# EAGLE design Adafruit Feather M4 Express CAN (EAGLE 9.6.2)
COMPANY: ADAFRUIT INDUSTRIES; DRAWN: KTOWN; REV: B
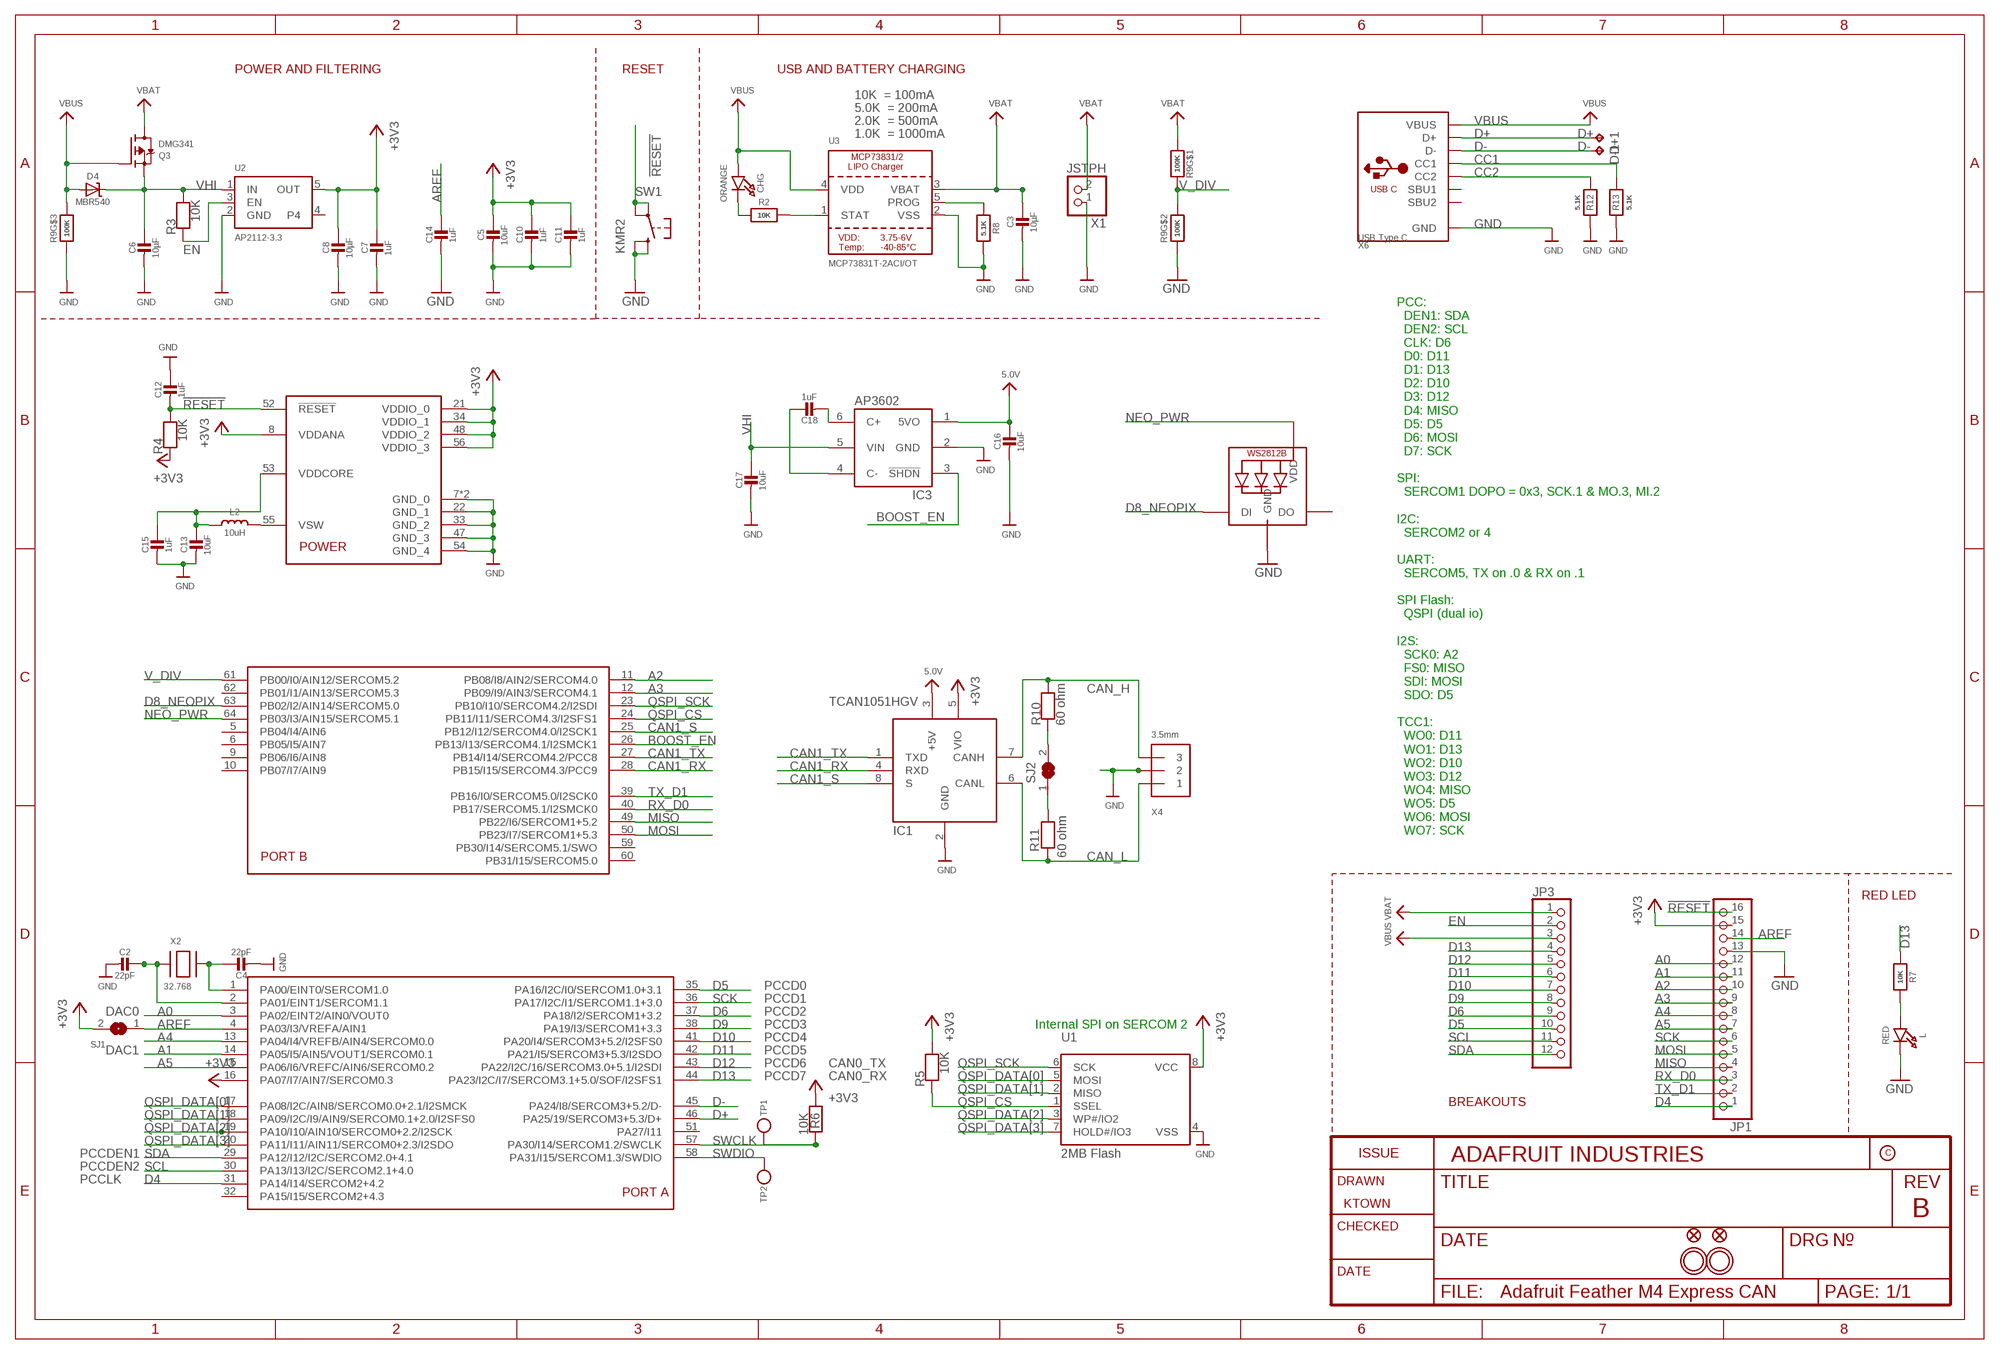
[diagram p0: schematic, sheet 1]

## Parts
C2  22pF  CAP_CERAMIC0603_NO  [0603-NO]
C3  10µF  CAP_CERAMIC0805-NOOUTLINE  [0805-NO]
C4  22pF  CAP_CERAMIC0603_NO  [0603-NO]
C5  10uF  CAP_CERAMIC0805-NOOUTLINE  [0805-NO]
C6  10µF  CAP_CERAMIC0805-NOOUTLINE  [0805-NO]
C7  1uF  CAP_CERAMIC0603_NO  [0603-NO]
C8  10µF  CAP_CERAMIC0805-NOOUTLINE  [0805-NO]
C10  1uF  CAP_CERAMIC0603_NO  [0603-NO]
C11  1uF  CAP_CERAMIC0603_NO  [0603-NO]
C12  1uF  CAP_CERAMIC0603_NO  [0603-NO]
C13  10uF  CAP_CERAMIC0805-NOOUTLINE  [0805-NO]
C14  1uF  CAP_CERAMIC0603_NO  [0603-NO]
C15  1uF  CAP_CERAMIC0603_NO  [0603-NO]
C16  10uF  CAP_CERAMIC_0805MP  [_0805MP]
C17  10uF  CAP_CERAMIC0805-NOOUTLINE  [0805-NO]
C18  1uF  CAP_CERAMIC0805_10MGAP  [0805_10MGAP]
CHG  ORANGE  LED0603_NOOUTLINE  [CHIPLED_0603_NOOUTLINE]
D4  MBR540  DIODE-SCHOTTKYSOD-123  [SOD-123]
D+1  TPB1,27  [B1,27]
D-1  TPB1,27  [B1,27]
IC1  TCAN1051HGV  CAN_TRANSCIEVER_TCAN1051V  [SOIC8_150MIL]
IC3  AP3602  [SOT23-6]
JP1  HEADER-1X16ROUND  [1X16_ROUND]
JP3  HEADER-1X12  [1X12_ROUND]
L  RED  LED0603_NOOUTLINE  [CHIPLED_0603_NOOUTLINE]
L2  10uH  INDUCTOR  [INDUCTOR_1007]
LED1  WS2812B3535  [LED3535]
Q3  DMG341  MOSFET-P  [SOT23-R]
R2  10K  RESISTOR_0603_NOOUT  [0603-NO]
R3  10K  RESISTOR_0603_NOOUT  [0603-NO]
R4  10K  RESISTOR_0603_NOOUT  [0603-NO]
R5  10K  RESISTOR_0603_NOOUT  [0603-NO]
R6  10K  RESISTOR_0603_NOOUT  [0603-NO]
R7  10K  RESISTOR_0603_NOOUT  [0603-NO]
R8  5.1K  RESISTOR_0603_NOOUT  [0603-NO]
R9  100K  RESISTOR_4PACK_NO  [RESPACK_4X0603_NO]
R10  60 ohm  RESISTOR0805_NOOUTLINE  [0805-NO]
R11  60 ohm  RESISTOR0805_NOOUTLINE  [0805-NO]
R12  5.1K  RESISTOR_0603_NOOUT  [0603-NO]
R13  5.1K  RESISTOR_0603_NOOUT  [0603-NO]
SJ1  SOLDERJUMPERCLOSED  [SOLDERJUMPER_CLOSEDWIRE]
SJ2  SOLDERJUMPER_CLOSED  [SOLDERJUMPER_CLOSEDWIRE]
SW1  KMR2  SWITCH_TACT_SMT4.6X2.8  [BTN_KMR2_4.6X2.8]
TP1  TESTPOINTROUND1.5MM  [TESTPOINT_ROUND_1.5MM]
TP2  TESTPOINTROUND1.5MM  [TESTPOINT_ROUND_1.5MM]
U1  2MB Flash  SPIFLASH_8PINUX  [USON8]
U2  AP2112-3.3  VREG_SOT23-5  [SOT23-5@1]
U3  MCP73831T-2ACI/OT  MCP73831/2  [SOT23-5]
U$14  ATSAMD51J  [PQFN64-1]
U$31  MOUNTINGHOLE2.5  [MOUNTINGHOLE_2.5_PLATED]
U$32  MOUNTINGHOLE2.5  [MOUNTINGHOLE_2.5_PLATED]
U$34  FIDUCIAL_1MM  [FIDUCIAL_1MM]
U$35  FIDUCIAL_1MM  [FIDUCIAL_1MM]
X1  JSTPH  CON_JST_PH_2PIN_BATT  [JSTPH2_BATT]
X2  32.768  XTAL-3.2X1.5  [XTAL3215]
X4  3.5mm  TERMBLOCK_1X3  [TERMBLOCK_1X3-3.5MM]
X6  USB Type C  USB_C  [USB_C_CUSB31-CFM2AX-01-X]

## Nets
5.0V [power]: C16.1 IC1.3(+5V) IC3.1(5VO)
!RESET: C12.2 JP1.16 R4.2 SW1.A'(P1) SW1.A(P) U$14.52(!RESET)
+3V3 [power]: C5.1 C7.1 C8.1 C10.1 C11.1 IC1.5(VIO) JP1.15 R4.1 R5.2 R6.1 SJ1.2 U1.8(VCC) U2.5(OUT) U$14.8(VDDANA) U$14.16(PA07/I7/AIN7/SERCOM0.3) U$14.21(VDDIO_0) U$14.34(VDDIO_1) U$14.48(VDDIO_2) U$14.56(VDDIO_3)
A0: JP1.12 U$14.3(PA02/EINT2/AIN0/VOUT0)
A1: JP1.11 U$14.14(PA05/I5/AIN5/VOUT1/SERCOM0.1)
A2: JP1.10 U$14.11(PB08/I8/AIN2/SERCOM4.0)
A3: JP1.9 U$14.12(PB09/I9/AIN3/SERCOM4.1)
A4: JP1.8 U$14.13(PA04/I4/VREFB/AIN4/SERCOM0.0)
A5: JP1.7 U$14.15(PA06/I6/VREFC/AIN6/SERCOM0.2)
AREF: C14.1 JP1.14 SJ1.1 U$14.4(PA03/I3/VREFA/AIN1)
BOOST_EN: IC3.3(!SHDN) U$14.26(PB13/I13/SERCOM4.1/I2SMCK1)
CAN1_RX: IC1.4(RXD) U$14.28(PB15/I15/SERCOM4.3/PCC9)
CAN1_S: IC1.8(S) U$14.25(PB12/I12/SERCOM4.0/I2SCK1)
CAN1_TX: IC1.1(TXD) U$14.27(PB14/I14/SERCOM4.2/PCC8)
CAN_H: IC1.7(CANH) R10.2 X4.3
CAN_L: IC1.6(CANL) R11.2 X4.1
CC1: R13.2 X6.A5(CC1)
CC2: R12.2 X6.B5(CC2)
D4: JP1.1 U$14.31(PA14/I14/SERCOM2+4.2)
D5: JP3.10 U$14.35(PA16/I2C/I0/SERCOM1.0+3.1)
D6: JP3.9 U$14.37(PA18/I2/SERCOM1+3.2)
D8_NEOPIX: LED1.1(DI) U$14.63(PB02/I2/AIN14/SERCOM5.0)
D9: JP3.8 U$14.38(PA19/I3/SERCOM1+3.3)
D10: JP3.7 U$14.41(PA20/I4/SERCOM3+5.2/I2SFS0)
D11: JP3.6 U$14.42(PA21/I5/SERCOM3+5.3/I2SDO)
D12: JP3.5 U$14.43(PA22/I2C/16/SERCOM3.0+5.1/I2SDI)
D13: JP3.4 R7.1 U$14.44(PA23/I2C/I7/SERCOM3.1+5.0/SOF/I2SFS1)
D+: D+1.TP U$14.46(PA25/19/SERCOM3+5.3/D+) X6.A6(D+) X6.B6(D+)
D-: D-1.TP U$14.45(PA24/I8/SERCOM3+5.2/D-) X6.A7(D-) X6.B7(D-)
EN: JP3.2 R3.1 U2.3(EN)
GND [power]: C2.2 C3.2 C4.2 C5.2 C6.2 C7.2 C8.2 C10.2 C11.2 C12.1 C13.2 C14.2 C15.2 C16.2 C17.2 IC1.2(GND) IC3.2(GND) JP1.13 L.C LED1.4(GND) R8.2 R9.3 R9.7 R12.1 R13.1 SW1.B'(S1) SW1.B(S) U1.4(VSS) U2.2(GND) U3.2(VSS) U$14.7(GND_0) U$14.22(GND_1) U$14.33(GND_2) U$14.47(GND_3) U$14.54(GND_4) U$14.EXP(GND_0) X1.1 X4.2 X6.A1B12(GND) X6.B1A12(GND)
MISO: JP1.4 U$14.49(PB22/I6/SERCOM1+5.2)
MOSI: JP1.5 U$14.50(PB23/I7/SERCOM1+5.3)
N$1: CHG.C R2.1
N$2: L.A R7.2
N$3: R2.2 U3.1(STAT)
N$4: R8.1 U3.5(PROG)
N$6: R10.1 SJ2.2
N$7: C4.1 U$14.1(PA00/EINT0/SERCOM1.0) X2.P$2
N$8: C18.2 IC3.6(C+)
N$9: C18.1 IC3.4(C-)
N$10: C2.1 U$14.2(PA01/EINT1/SERCOM1.1) X2.P$1
N$11: L2.P$2 U$14.55(VSW)
N$13: R11.1 SJ2.1
NEO_PWR: LED1.2(VDD) U$14.64(PB03/I3/AIN15/SERCOM5.1)
QSPI_CS: R5.1 U1.1(SSEL) U$14.24(PB11/I11/SERCOM4.3/I2SFS1)
QSPI_DATA[0]: U1.5(MOSI) U$14.17(PA08/I2C/AIN8/SERCOM0.0+2.1/I2SMCK)
QSPI_DATA[1]: U1.2(MISO) U$14.18(PA09/I2C/I9/AIN9/SERCOM0.1+2.0/I2SFS0)
QSPI_DATA[2]: U1.3(WP#/IO2) U$14.19(PA10/I10/AIN10/SERCOM0+2.2/I2SCK)
QSPI_DATA[3]: U1.7(HOLD#/IO3) U$14.20(PA11/I11/AIN11/SERCOM0+2.3/I2SDO)
QSPI_SCK: U1.6(SCK) U$14.23(PB10/I10/SERCOM4.2/I2SDI)
RX_D0: JP1.3 U$14.40(PB17/SERCOM5.1/I2SMCK0)
SCK: JP1.6 U$14.36(PA17/I2C/I1/SERCOM1.1+3.0)
SCL: JP3.11 U$14.30(PA13/I13/I2C/SERCOM2.1+4.0)
SDA: JP3.12 U$14.29(PA12/I12/I2C/SERCOM2.0+4.1)
SWCLK: R6.2 TP1.P$1 U$14.57(PA30/I14/SERCOM1.2/SWCLK)
SWDIO: TP2.P$1 U$14.58(PA31/I15/SERCOM1.3/SWDIO)
TX_D1: JP1.2 U$14.39(PB16/I0/SERCOM5.0/I2SCK0)
V_DIV: R9.1 R9.2 U$14.61(PB00/I0/AIN12/SERCOM5.2)
VBAT [power]: C3.1 JP3.1 Q3.3(D) R9.8 U3.3(VBAT) X1.2
VBUS [power]: CHG.A D4.A JP3.3 Q3.1(G) R9.6 U3.4(VDD) X6.A4B9(VBUS) X6.B4A9(VBUS)
VDDCORE1: C13.1 C15.1 L2.P$1 U$14.53(VDDCORE)
VHI [power]: C6.1 C17.1 D4.C IC3.5(VIN) Q3.2(S) R3.2 U2.1(IN)
Unconnected: LED1.3(DO) R9.4 R9.5 U2.4 U$14.5(PB04/I4/AIN6) U$14.6(PB05/I5/AIN7) U$14.9(PB06/I6/AIN8) U$14.10(PB07/I7/AIN9) U$14.32(PA15/I15/SERCOM2+4.3) U$14.51(PA27/I11) U$14.59(PB30/I14/SERCOM5.1/SWO) U$14.60(PB31/I15/SERCOM5.0) U$14.62(PB01/I1/AIN13/SERCOM5.3) X6.A8(SBU1) X6.B8(SBU2)

## Notes on the sheet
- POWER AND FILTERING | RESET | USB AND BATTERY CHARGING
- 10K  = 100mA
- 5.0K  = 200mA
- 2.0K  = 500mA
- 1.0K  = 1000mA
- PCC:
    DEN1: SDA
    DEN2: SCL
    CLK: D6
    D0: D11
    D1: D13
    D2: D10
    D3: D12
    D4: MISO
    D5: D5
    D6: MOSI
    D7: SCK
  
  SPI:
    SERCOM1 DOPO = 0x3, SCK.1 & MO.3, MI.2
  
  I2C:
    SERCOM2 or 4
  
  UART:
    SERCOM5, TX on .0 & RX on .1
  
  SPI Flash:
    QSPI (dual io)
  
  I2S:
    SCK0: A2
    FS0: MISO
    SDI: MOSI
    SDO: D5
  
  TCC1:
    WO0: D11
    WO1: D13
    WO2: D10
    WO3: D12
    WO4: MISO
    WO5: D5
    WO6: MOSI
    WO7: SCK
- RED LED
- PCCD0
- PCCD1
- DAC0 | PCCD2
- PCCD3 | Internal SPI on SERCOM 2
- PCCD4
- DAC1 | PCCD5
- PCCD6 | CAN0_TX
- PCCD7 | CAN0_RX
- BREAKOUTS
- PCCDEN1
- PCCDEN2
- PCCLK

## Library data of the parts
C2-C7 C10-C18 = microbuilder:CAP_CERAMIC: Ceramic Capacitors For new designs, use the packages preceded by an '_' character since they are more reliable: The following footprints should be used on most boards: _0402 - Standard footprint for regular board layouts _0603 - Standard footprint for regular board layouts _0805 - Standard footprint for regular board layouts _1206 - Standard footprint for regular board layouts For extremely tight-pitch boards where space is at a premium, the following 'micro-pitch' footprints can be used (smaller pads, no silkscreen outline, etc.): _0402MP - Micro-pitch footprint for very dense/compact boards _0603MP - Micro-pitch footprint for very dense/compact boards _0805MP - Micro-pitch footprint for very dense/compact boards _1206MP - Micro-pitch footprint for very dense/compact boards
C8 = microbuilder:CAP_CERAMIC: Ceramic Capacitors For new designs, use the packages preceded by an '_' character since they are more reliable: The following footprints should be used on most boards: _0402 - Standard footprint for regular board layouts _0603 - Standard footprint for regular board layouts _0805 - Standard footprint for regular board layouts _1206 - Standard footprint for regular board layouts For extremely tight-pitch boards where space is at a premium, the following 'micro-pitch' footprints can be used (smaller pads, no silkscreen outline, etc.): _0402MP - Micro-pitch footprint for very dense/compact boards _0603MP - Micro-pitch footprint for very dense/compact boards _0805MP - Micro-pitch footprint for very dense/compact boards _1206MP - Micro-pitch footprint for very dense/compact boards; REV: C
CHG L = microbuilder:LED: LED 0603 - 0603 Surface Mount Package 2mA: Green LED - Low Power (3.9mcd, 2ma, 1.7Vf) - Digikey: 475-2709-2-ND Orange LED - Low Power (9.8mcd, 2ma, 1.8Vf) - Digikey: 475-1194-2-ND Red LED - Low Power (5mcd, 2ma, 1.8Vf) - Digikey: 475-1195-2-ND Yellow LED - Low Power (7mcd, 2ma, 1.8Vf) - Digikey: 475-1196-2-ND 5mA: Blue LED - Low Power (17mcd, 5ma, 2.9Vf) - Digikey: LNJ937W8CRACT-ND 0805 - 0805 Surface Mount Package 2mA: Red LED (8.8mcd, 2mA, 1.8Vf, Clear) - Low Power [Digikey: 475-2510-1-ND] Green LED (5mcd, 2mA, 1.8Vf, Clear) - Low Power [Digikey: 475-2730-1-ND] Yellow LED (11.3mcd, 2mA, 1.8Vf, Clear) - Low Power [Digikey: 475-2555-1-ND] 20mA: Red LED (104mcd, 20mA, Diffused) - LS R976 [Digikey: 475-1278-6-ND] Red LED (12mcd, 20mA, 2.0Vf, Clear) - APT2012EC [Digikey: 754-1128-1-ND] Green LED (15mcd, 20mA, 2.2Vf, Clear) - APT2012GC [Digikey: 754-1131-1-ND] Orange LED (160mcd, 20mA, 2.1Vf, Clear) - APT2012SECK [Digikey: 754-1130-1-ND] 1206 - 1206 Surface Mount Package Green LED (26mcd, 20mA, Diffused) - LG N971 [Digikey: 475-1407-6-ND] Red LED (15mcd, 20mA, Diffused) - LH N974 [Digikey: 475-1416-6-ND] Cree - Cree High-Power Surface Mount LEDs XPEBWT-L1-0000-00D50 - White 111lm 350mA 2.9Vf 6200K 110° XTEAWT-00-0000-00000LEE3 - White 114lm 350mA 2.85Vf 5000K 115° Everlight - Everlight 45-21 Series Surface Mount LEDs 45-21/QK2C-B2832AC2CB2/2T - Warm White 2000mcd 20mA 3.25Vf 3050K 120° 45-21/LK2C-B38452C4CB2/2T - Nuetral White 2000mcd 20mA 3.25Vf 4150K 120° 45-21/LK2C-B50634C6CB2/2T - Cold White 2200mcd 20mA 3.25Vf 5650K 120° PLCC2 Reverse Mount LS T77K-J1L2-1-0-2-R18-Z - Red 11.25mcd 2mA 1.8Vf 630nm 120° LO T77K-L1M2-24-Z - Orange 19.6mcd 2mA 1.8Vf 606nm 120° LY T77K-K2M1-26-Z - Yellow 15.7mcd 2mA 1.8Vf 587nm 120°
D4 = microbuilder:DIODE-SCHOTTKY
D+1 D-1 = testpad:TP: Test pad
IC1 = microbuilder:CAN_TRANSCIEVER
IC3 = microbuilder:AP3602
JP1 = microbuilder:HEADER-1X16: PIN HEADER
JP3 = microbuilder:HEADER-1X12
L2 = microbuilder:INDUCTOR: Inductors 0603: 10nH Ceramic Inductor - microwire antenna/RF (Digikey: 712-1434-2-ND) 0805: 560nH Ceramic Inductor - RF (Digikey: 553-1047-1-ND) 270nH Ceramic Inductor - Q = 40@250MHz, +-5%, 1 Ohm DC Resistance (Digikey: 535-10506-2-ND) 1007 (2518 Metric) SMT: 10µH 10% 250mOhm 820mA 1007 Inductor (Digikey: 587-2189-1-ND) 22µH 10% 500mOhm 580mA 1007 Inductor (Digikey: 587-2190-1-ND) 47µH 10% 950mOhm 420mA 1007 Inductor (Digikey: 587-2191-1-ND) 47µH 5% 100mOhm 1A 1008 Inductor (Digikey: 732-1816-1-ND) 5.0x5.0mm (Taiyo Yuden NR5040 Series) 6.8µH 20% 2.3A 64mOhm Inductor (Digikey: 587-2374-2-ND) 5.0x5.0mm (TDK VLC5045 Series) 4.7µH 20% 3.3A 34mOhm Inductor (Digikey: 445-6526-1-ND) 6.8µH 20% 2.7A 46mOhm Inductor (Digikey: 445-6527-1-ND) 6.0x6.0mm (TDK VLC6045 Series) 4.7µH 20% 3.8A 27mOhm Inductor (Digikey: 445-6538-2-ND) 6.8µH 20% 3A 41mOhm Inductor (Digikey: 445-6540-1-ND) 6.2µH 30% 2.2A 45mOhm Inductor (Digikey: SRR5028-6R2YCT-ND) - Not TDK VLC6045 but footprint should match 6.0x6.0mm (TDK SLF6045 Series) 6.8uH 30% 2A 33mOhm Inductor (Digikey: 445-4572-1-ND, Mouser: 810-SLF645T6R8N2R0PF) 6.0x6.0mm (Sumida CDRH5D28 Series) 6.2uH 30% 1.8A 45mOhm Inductor (Digikey: 308-1542-1-ND) Taiyo Yuden NR3015T2R2M - 2.2uH 20% 1.5A (Digikey: 587-1648-2-ND, Mouser: 963-NR3015T2R2M) - Used with TI TPS62172 CoilCraft RFID Transponder Coil - MA5532-AE (For use with AS3935 Lightning Sensor) Taiyo Yuden NRH2412T2R2MNGH - 2.2uH 20% 1AA (Digikey: 587-3443-1-ND) - Used with TI LM3671 Vishay IHLP 1.0uH Molded Inductor - 24mOhm DCR, 5A, +/-20%, -55°C-125°C (Digikey: 541-1319-1-ND)
LED1 = microbuilder:WS2812B
Q3 = microbuilder:MOSFET-P: P-Channel Mosfet LEGEND VDS: Voltage Drain-Source ID: Drain Current RDS(ON): Drain-Source On-State Resistance VGS(TH): Gate-Source Threshold Voltage CISS: Drain-Source Input Capacitance SOT-23 Name VDS ID RDS(ON) VGS(TH) CISS Order Number IRLML5103 30V 760mA 600 mOhm -- 75pF @ 25V Digikey: IRLML5103PBFCT-ND IRLML6401 12V 4.3A 50 mOhm 950mV @ 250µA 830pF @ 10V Digikey: IRLML6401PBFTR-ND NTR0202PL 20V 400mA 800 mOhm 2.3V @ 250uA 70pF @ 5V Digikey: NTR0202PLT1GOSTR-ND NTR4101PT1G 20V 1.8A 85 mOhm 1.2V @ 250uA 675pF @ 10V Digikey: NTR4101PT1GOSCT-ND DMP2004K 20V 600mA 900 mOhm 1V @ 250uA 175pF @ 16V Digikey: DMP2004KDICT-ND PMV65XP 20V 3.9A 76 mOhm 950mV @ 1mA 725pF @ 20V Digikey: 568-2358-2-ND TO-252 Name VDS ID RDS(ON) VGS(TH) CISS Order Number AOD417 30V 25A 34 mOhm 3V @ 250µA 920pF @ 15V Digikey: 785-1106-2-ND PowerPak Name VDS ID RDS(ON) VGS(TH) CISS Order Number AON7401 30V 12A 14 mOhm 3V @ 250µA 2600pF @ 15V Digikey: 785-1302-1-ND
R2-R8 R10-R13 = microbuilder:RESISTOR: Resistors For new designs, use the packages preceded by an '_' character since they are more reliable: The following footprints should be used on most boards: _0402 - Standard footprint for regular board layouts _0603 - Standard footprint for regular board layouts _0805 - Standard footprint for regular board layouts _1206 - Standard footprint for regular board layouts For extremely tight-pitch boards where space is at a premium, the following 'micro-pitch' footprints can be used (smaller pads, no silkscreen outline, etc.): _0402MP - Micro-pitch footprint for very dense/compact boards _0603MP - Micro-pitch footprint for very dense/compact boards _0805MP - Micro-pitch footprint for very dense/compact boards _1206MP - Micro-pitch footprint for very dense/compact boards
R9 = microbuilder:RESISTOR_4PACK: Resistor Packs (4 resistors) 4 x 0603 10K 1/16W - Digikey: YC164J-10KCT-ND
SJ1 = microbuilder:SOLDERJUMPER: SMD Solder JUMPER Solder the two pads together to create a connection, or remove the solder to break it. REFLOW - Use this footprint for solder paste and reflow ovens. WAVE - Use this footprint for hand-soldering (larger pads). CLOSED - Has a trace between the two pads to ensure it is closed by default. The trace needs to be cut to disable the jumper, and can be closed again by creating a solder bridge between the two pads.
SJ2 = microbuilder:SOLDERJUMPER_CLOSED: Solder Jumper - Closed These solder jumpers are closed by default CLOSEDWIRE - 10 mil trace between pads that can be cut and resoldered later CLOSEDPERM - 63 mil trace between pads for a permanent connection (used to 'bridge' two signals, a shameless hack for Eagle). Can double as a test point as well (no cream layer)
SW1 = microbuilder:SWITCH_TACT_SMT: SMT Tact Switches 6x6mm - Digikey: P12940SCT-ND KMR2 (4.6x2.8mm) - Digikey: 401-1426-1-ND EVQ-PQHB55 - Light Touch, 160GF (4.5x4.5mm) - Digikey: P8090SCT-ND KMT0 - KMT021 NGJ LHS (etc.) IP68/Waterproof - Digikey: CKN10289CT-ND
TP1 TP2 = microbuilder:TESTPOINT: Test Point Various test points for characterisation and PCB testing TESTPOINT_SMT - Compact Surface Mount Test Point [Digikey: 5016KTR-ND]
U1 = microbuilder:SPIFLASH_8PIN: SOIC8 SPI Flash Be careful with the size since SOIC8 flash comes in several 'widths' SOIC8 150 mil M25P16 - 16Mbit (2Mbit x 8) Serial Flash (75MHz SPI Bus), Supply: 2.7-3.6V Digikey: SOIC8 - M25P16-VMN6P-ND SOIC8 208 mil W25Q16BVSSIG - 16Mbit (2Mbit x 8) Serial Flash (104MHz SPI Bus), Supply: 2.7-3.6V Digikey: SOIC8 - W25Q16BVSSIG-ND
U2 = microbuilder:VREG_SOT23-5: SOT23-5 Fixed Voltage Regulators Part Current Out V Out V In V Dropout θJA (°C/W) TJ (°C) Digikey Part No. ADP121 150mA 3.3V 3.4-5.5V 0.09V @ 150mA -- -- ADP121-AUJZ33R7CT-ND ADP121 150mA 3.0V 3.1-5.5V 0.09V @ 150mA -- -- ADP121-AUJZ30R7CT-ND ADP122 300mA 3.3V 3.4-5.5V 0.085V @ 300mA -- -- ADP122AUJZ-3.3-R7CT-ND ADP1712 300mA 3.3V 3.5-5.5V 0.17V @ 300mA -- -- ADP1712AUJZ-3.3-R7TR-ND AP7311 (Low Cost) 150mA 3.3V 3.5-6V 0.15V @ 150mA -- -- AP7311-33WG-7DICT-ND LD39015M18R 150mA 1.8V 1.9V-5.5V 0.08V @ 100mA -- -- 497-6977-1-ND LP2985A-33DBVR 150mA 3.3V 3.3-16V 0.28V @ 150mA 206 150 296-18479-1-ND MCP1824T-3302E/OT 300mA 3.3V 3.5V-6V 0.2V @ 300mA -- -- MCP1824T-3302E/OTCT-ND MIC5205-2.5YM5 TR 150mA 2.5V 2.7-16V 0.165V @ 150mA -- -- 576-1257-2-ND MIC5205-3.0YM5 TR 150mA 3.0V 3.2V-16V 0.165V @ 150mA -- -- 576-1258-2-ND MIC5205-3.3YM5 TR 150mA 3.3V 3.5V-16V 0.165V @ 150mA -- -- 576-1259-2-ND TPS780330220 150mA 3.3V+2.2V 3.6-5.5V 250mV Max -- -- 296-23332-1-ND TDA3663/N1,135 100mA 3.3V 3.5-45V 0.18V @ 50mA -- -- 568-5343-1-ND Max operating temp can be calculated using θJA, TJ (max junction temperature), and power in watts. Set the "Maximum Ambient Temperature" until it reaches TJ ("Max Junction Temperature"), which is the absolute limit for safe use of the regulator: Heat Sink Temperature Calculator <http://www.daycounter.com/Calculators/Heat-Sink-Temperature-Calculator.phtml> For example, With 12V source into a 3.3V LP2985 and a 30mA load, we are dissipating (12V-3.3V) * 0.03A = 0.261W. With a θJA of 206 °C/W, a TJ of 150°C, and 261mW we can safely use the chip without a heat sink up to 75°C (=147.1°C Junction Temperature).
U3 = microbuilder:MCP73831/2: MCP73831/2 LIPO Charger VDD: 3.75 - 6V Temp -40 - 85°C Programmable Charge Rate: 15-500mA NOTE: STAT is a tri-state logic output on the MCP73831 and an open-drain output on the MCP73832. SOT23-5 with 4.2V output and tri-state logic on STAT = MCP73831T-2ACI/OT
U$14 = microbuilder:ATSAMD51J: ATSAMD51J cortex m4 microcontroller
U$31 U$32 = microbuilder:MOUNTINGHOLE: Mounting Hole For #2 screws (0.086"/2.18mm width, 0.094"/2.4mm hole) use 2.5mm; BOM: EXCLUDE
U$34 U$35 = microbuilder:FIDUCIAL: Fiducial Alignment Points Various fiducial points for machine vision alignment.; BOM: EXCLUDE
X1 = microbuilder:CON_JST_PH_2PIN: JST 2-Pin Right-Angle Connector PH-Series - 4UConnector: 17311 SH-Series - 4UConnector: 07278
X2 = adafruit2:XTAL: Low cost SMT crystals, no capacitors included http://www.ladyada.net/library/eagle
X4 = microbuilder:TERMBLOCK_1X3: 3.5mm Terminal block http://www.ladyada.net/library/pcb/eaglelibrary.html
X6 = microbuilder:USB_C: USB Type-C USB 2.0 Connector

## Net classes
1 power: width 0.305 mm
2 gnd: width 0.254 mm

## Board
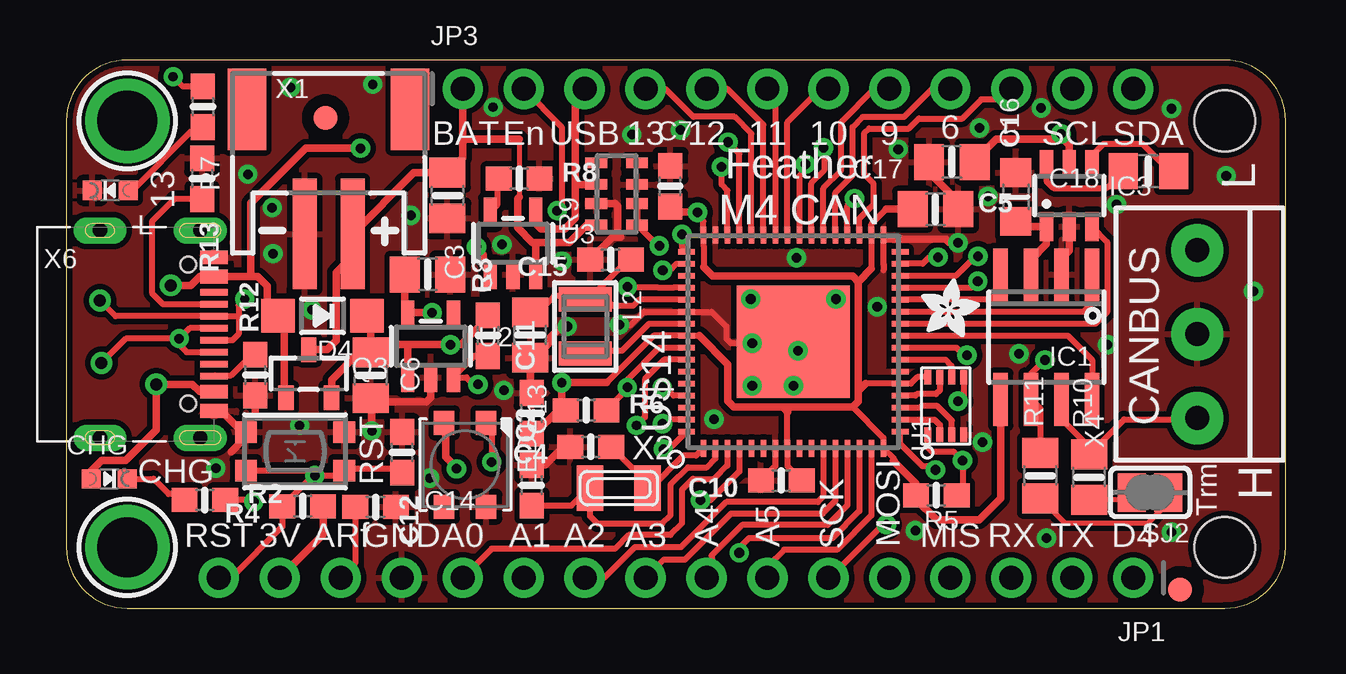
[diagram p1: board, top side]
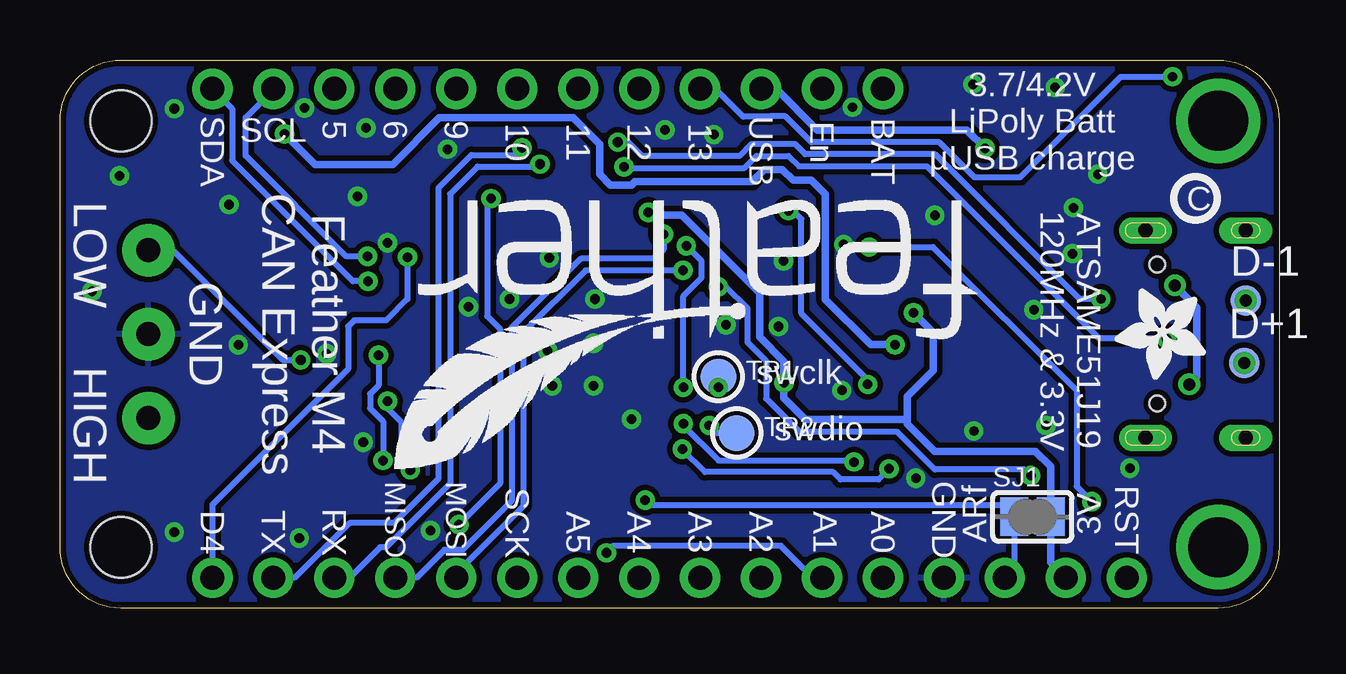
[diagram p2: board, bottom side, seen from below]

Size 50.8 x 22.86 mm. Coordinates in mm from the lower left corner, seen from the top.
Outline: 2.54,0 48.26,0 arc90 50.8,2.54 50.8,20.32 arc90 48.26,22.86 2.54,22.86 arc90 0,20.32 0,2.54 arc90 2.54,0
Copper layers (1*16): Top 0.035mm / dielectric 1.5mm / Bottom 0.035mm
Design rules "adafruit *": minimum track width 8mil, minimum drill 15.5mil, track to track 9mil, track to pad 8mil, pad to pad 8mil, via to via 8mil, smd to smd 8mil, copper to edge 10mil, drill to drill 8mil, minimum pad ring 10mil, minimum via ring 8mil, stop-mask expansion 2mil, vias tented up to drill 20mil, thermal gap 10mil
Holes 2.54 mm at 48.26,20.32 48.26,2.54

### Footprints (pad centres in the part's own frame; a part is rotated, then mirrored left to right if it is on the bottom)
0603-NO = smd 1.075 x 1: 1 -0.85,0; 2 0.85,0
0805-NO = smd 1.24 x 1.5: 1 -0.95,0; 2 0.95,0
_0805MP = smd 1.2 x 1.3: 1 -1.016,0; 2 1.016,0
0805_10MGAP = smd 1.2 x 1.5: 1 -1.05,0; 2 1.05,0
CHIPLED_0603_NOOUTLINE = smd 0.8 x 0.8: A 0,-0.75; C 0,0.75
SOD-123 = smd 1.4 x 1.4: A 1.85,0; C -1.85,0
B1,27 = smd 1.27 x 1.27: TP 0,0
SOIC8_150MIL = smd 0.6 x 2.2: 1 -1.905,-2.6; 2 -0.635,-2.6; 3 0.635,-2.6; 4 1.905,-2.6; 5 1.905,2.6; 6 0.635,2.6; 7 -0.635,2.6; 8 -1.905,2.6
SOT23-6 = smd 0.55 x 1.2: 1 -0.95,-1.3; 2 0,-1.3; 3 0.95,-1.3; 4 0.95,1.3; 5 0,1.3; 6 -0.95,1.3
1X16_ROUND = drill 1 pad 1.676: 1 -19.05,0; 2 -16.51,0; 3 -13.97,0; 4 -11.43,0; 5 -8.89,0; 6 -6.35,0; 7 -3.81,0; 8 -1.27,0; 9 1.27,0; 10 3.81,0; 11 6.35,0; 12 8.89,0; 13 11.43,0; 14 13.97,0; 15 16.51,0; 16 19.05,0
1X12_ROUND = drill 1 pad 1.676: 1 -13.97,0; 2 -11.43,0; 3 -8.89,0; 4 -6.35,0; 5 -3.81,0; 6 -1.27,0; 7 1.27,0; 8 3.81,0; 9 6.35,0; 10 8.89,0; 11 11.43,0; 12 13.97,0
INDUCTOR_1007 = smd 1.016 x 2.2: P$1 -1.127,0; P$2 1.127,0
LED3535 = smd 1 x 0.85: 1 -1.75,0.875; 2 -1.75,-0.875; 3 1.75,-0.875; 4 1.75,0.875
SOT23-R = smd 0.635 x 1.016: 1 -0.95,-1; 2 0.95,-1; 3 0,1
RESPACK_4X0603_NO = smd 0.45 x 0.9: 1 -1.3,-0.85; 2 -0.4,-0.85; 3 0.4,-0.85; 4 1.3,-0.85; 5 1.3,0.85; 6 0.4,0.85; 7 -0.4,0.85; 8 -1.3,0.85
SOLDERJUMPER_CLOSEDWIRE = smd 1.168 x 1.6: 1 -0.762,0; 2 0.762,0 | smd 0.635 x 0.203: WIRE 0,0
BTN_KMR2_4.6X2.8 = smd 0.9 x 0.9: A 2.05,0.8; A' -2.05,0.8; B 2.05,-0.8; B' -2.05,-0.8
TESTPOINT_ROUND_1.5MM = smd 1.5 x 1.5: P$1 0,0
USON8 = smd 0.6 x 0.275: 1 -1.2,0.75; 2 -1.2,0.25; 3 -1.2,-0.25; 4 -1.2,-0.75; 5 1.2,-0.75; 6 1.2,-0.25; 7 1.2,0.25; 8 1.2,0.75
SOT23-5@1 = smd 0.55 x 1.2: 1 -0.95,-1.3; 2 0,-1.3; 3 0.95,-1.3; 4 0.95,1.3; 5 -0.95,1.3
SOT23-5 = smd 0.55 x 1.2: 1 -0.95,-1.3; 2 0,-1.3; 3 0.95,-1.3; 4 0.95,1.3; 5 -0.95,1.3
PQFN64-1 = smd 0.7 x 0.22: 1 -4.45,3.75; 2 -4.45,3.25; 3 -4.45,2.75; 4 -4.45,2.25; 5 -4.45,1.75; 6 -4.45,1.25; 7 -4.45,0.75; 8 -4.45,0.25; 9 -4.45,-0.25; 10 -4.45,-0.75; 11 -4.45,-1.25; 12 -4.45,-1.75; 13 -4.45,-2.25; 14 -4.45,-2.75; 15 -4.45,-3.25; 16 -4.45,-3.75; 33 4.45,-3.75; 34 4.45,-3.25; 35 4.45,-2.75; 36 4.45,-2.25; 37 4.45,-1.75; 38 4.45,-1.25; 39 4.45,-0.75; 40 4.45,-0.25; 41 4.45,0.25; 42 4.45,0.75; 43 4.45,1.25; 44 4.45,1.75; 45 4.45,2.25; 46 4.45,2.75; 47 4.45,3.25; 48 4.45,3.75 | smd 0.22 x 0.7: 17 -3.75,-4.45; 18 -3.25,-4.45; 19 -2.75,-4.45; 20 -2.25,-4.45; 21 -1.75,-4.45; 22 -1.25,-4.45; 23 -0.75,-4.45; 24 -0.25,-4.45; 25 0.25,-4.45; 26 0.75,-4.45; 27 1.25,-4.45; 28 1.75,-4.45; 29 2.25,-4.45; 30 2.75,-4.45; 31 3.25,-4.45; 32 3.75,-4.45; 49 3.75,4.45; 50 3.25,4.45; 51 2.75,4.45; 52 2.25,4.45; 53 1.75,4.45; 54 1.25,4.45; 55 0.75,4.45; 56 0.25,4.45; 57 -0.25,4.45; 58 -0.75,4.45; 59 -1.25,4.45; 60 -1.75,4.45; 61 -2.25,4.45; 62 -2.75,4.45; 63 -3.25,4.45; 64 -3.75,4.45 | smd 4.7 x 4.7: EXP 0,0
MOUNTINGHOLE_2.5_PLATED = drill 2.5 pad 3.2: P$1 0,0
FIDUCIAL_1MM = smd 1 x 1: 1 0,0
JSTPH2_BATT = smd 1 x 4.6: 1 -1,-3.7; 2 1,-3.7 | smd 1.6 x 3.4: NC1 -3.4,1.5; NC2 3.4,1.5
XTAL3215 = smd 1.1 x 1.9: P$1 1.2,0; P$2 -1.2,0
TERMBLOCK_1X3-3.5MM = drill 1 pad 2.184: 1 3.5,0; 2 0,0; 3 -3.5,0
USB_C_CUSB31-CFM2AX-01-X = smd 0.575 x 1.15: A1B12 -3.2,3.545; A4B9 -2.4,3.545; B1A12 3.2,3.545; B4A9 2.4,3.545 | smd 0.275 x 1.15: A5 -1.25,3.545; A6 -0.25,3.545; A7 0.25,3.545; A8 1.25,3.545; B5 1.75,3.545; B6 0.75,3.545; B7 -0.75,3.545; B8 -1.75,3.545 | drill 0.6 pad 1 long: M1 -4.32,2.97; M2 4.32,2.97; M3 -4.32,-1.21; M4 4.32,-1.21 | hole 0.65: 2.89,2.47; -2.89,2.47

### Placement (x,y rotation side)
C2  19.39,5.13 90 top
C3  15.88,17.21 270 top
C4  21.84,6.73 180 top
C5  36.21,16.64 0 top
C6  12.68,9.71 270 top
C7  25.16,17.59 90 top
C8  15.05,13.92 0 top
C10  29.79,5.33 180 top
C11  19.38,8.13 90 top
C12  13.98,6.5 270 top
C13  19.32,11.39 270 top
C14  12.88,4.22 0 top
C15  22.67,14.54 180 top
C16  39.56,17.14 90 top
C17  36.89,18.61 180 top
C18  45.09,18.22 180 top
CHG  1.78,5.4 270 top
D4  10.67,12.19 180 top
D+1  1.46,10.22 0 bottom
D-1  1.4,12.83 0 bottom
IC1  40.83,11.3 180 top
IC3  41.78,17.21 0 top
JP1  25.4,1.27 180 top
JP3  30.48,21.65 0 top
L  1.82,17.42 90 top
L2  21.62,11.75 270 top
LED1  16.61,5.98 270 top
Q3  10.1,9.78 0 top
R2  5.77,4.51 0 top
R3  17.56,11.37 90 top
R4  9.84,4.25 180 top
R5  36.25,4.71 180 top
R6  21.65,8.26 0 top
R7  5.69,20.9 270 top
R8  18.86,17.91 0 top
R9  22.92,17.27 90 top
R10  42.61,5.46 90 top
R11  40.58,5.52 90 top
R12  7.87,9.72 90 top
R13  5.65,17.91 270 top
SJ1  10.29,3.81 0 bottom
SJ2  45.15,4.83 180 top
SW1  9.53,6.54 180 top
TP1  23.37,9.65 0 bottom
TP2  22.61,7.3 0 bottom
U1  36.64,8.43 90 top
U2  15.18,10.92 0 top
U3  18.61,15.21 0 top
U$1  [ADAFRUIT_2.5MM]  35.62,11.3 0 top
U$9  [FEATHERLOGO]  12.57,17.08 180 bottom
U$12  [ADAFRUIT_3.5MM]  3.05,13.34 180 bottom
U$13  [PCBFEAT-REV-040]  3.49,17.08 0 bottom
U$14  30.29,11.11 90 top
U$31  2.54,20.32 270 top
U$32  2.54,2.54 270 top
U$34  10.79,20.45 270 top
U$35  46.4,0.77 270 top
X1  10.92,19.3 0 top
X2  23.01,5 180 top
X4  47.12,11.43 90 top
X6  2.6,11.43 270 top

### Tracks (layer width: path | path; a pad name or v marks a point on that pad's centre or on a via)
5.0V
  Top 0.305: IC1.3 40.2,14.54 40.83,15.18 IC3.1 39.78,15.91 C16.1
!RESET  (via drill 0.39)
  Top 0.254: JP1.16 6.86,1.27 8.99,3.4 R4.2 10.26,5.52 v10.35,5.52 | v23.37,13.4 23.4,13.36 24.66,13.36 24.67,13.35 25.28,13.35 25.29,13.36 U$14.52 | SW1.A 10.13,5.74 v10.35,5.52 | C12.2 13.83,5.8 11.64,5.8 SW1.A' 11.36,5.52 v10.35,5.52
  Bottom 0.254: v23.37,13.4 23.05,13.4 22.16,12.51 22.16,11.09 21.38,10.31 21.38,8.74 20,7.37 15.94,7.37 14.35,5.78 10.6,5.78 v10.35,5.52
+3V3  (via drill 0.39, 0.4)
  Top 0.254: U1.8 35.45,9.63 35.18,9.36 U$14.21 33.3,9.36 | 22.51,9.41 24.46,11.36 U$14.56 26.36,11.36 | 34.16,16.64 33.54,16.01 U$14.34 33.54,14.15 | v26.29,16.51 26.29,16.38 26.54,16.13 U$14.48 26.54,15.12 26.55,15.12 26.55,14.22 | 30.04,8.17 U$14.8 30.04,5.93 C10.1 | 34.48,6.13 34.48,6.22 U$14.16 34.04,7.1 32.76,8.38
  Top 0.305: R4.1 10.69,3.07 JP1.15 | 22.51,9.41 20.84,9.41 20.83,9.4 v20.64,9.4 20.64,8.42 R6.1 20.48,8.26 19.51,7.28 C11.1 | 26.36,11.36 27.56,10.16 27.56,8.64 27.81,8.38 29.84,8.38 | 29.84,8.38 30.05,8.18 30.04,8.17 | 32.99,9.06 32.99,8.62 32.76,8.38 29.84,8.38 | 33.3,9.36 32.99,9.06 | 32.99,13.61 32.99,9.06 | 33.54,14.15 32.99,13.61 | 26.55,14.22 26.92,13.84 32.76,13.84 32.99,13.61 | IC1.5 38.92,4.57 38.04,3.68 36.26,3.68 35.4,4.55 R5.2 35.4,5.19 34.46,6.13 34.48,6.13 | C7.1 25.39,16.51 v26.29,16.51 | C5.1 34.16,16.64 | C8.1 14.1,12.35 U2.5 14.32,12.32 v15.24,12.32
  Bottom 0.305: JP1.15 9.53,1.91 SJ1.2 9.53,5.91 10.16,6.54 14.35,6.54 15.49,7.68 15.49,7.87 | v26.29,16.51 26.16,16.38 24.9,16.38 21.65,13.13 21.65,11.3 20.64,10.29 v20.64,9.4 20.64,8.76 19.75,7.87 15.49,7.87 | v15.24,12.32 14.41,11.49 14.41,9.91 15.49,8.83 15.49,7.87
A0
  Top 0.254: U$14.3 27.54,5.95 26.99,5.4 26.1,5.4 25.65,4.95 25.65,3.54 25.16,3.05 23.43,3.05 22.86,2.48 17.72,2.48 JP1.12
A1  (via drill 0.4)
  Top 0.254: U$14.14 33.04,4.05 31.91,2.92 28.43,2.92 28.03,2.52 v28.03,2.31
  Bottom 0.254: JP1.11 19.43,1.27 20.77,2.6 27.74,2.6 v28.03,2.31
A2
  Top 0.254: JP1.10 22.42,1.27 23.69,2.54 25.61,2.54 27.5,4.43 31.31,4.43 31.54,4.66 U$14.11
A3
  Top 0.254: JP1.9 24.89,2.03 25.78,2.03 27.7,3.95 31.51,3.95 32.04,4.48 U$14.12
A4
  Top 0.254: JP1.8 26.88,1.48 26.88,2.2 28.15,3.47 31.71,3.47 32.54,4.29 U$14.13
A5
  Top 0.254: JP1.7 29.21,1.74 29.91,2.44 32.11,2.44 33.54,3.87 U$14.15
AREF  (via drill 0.39)
  Top 0.254: C14.1 12.03,1.87 JP1.14 | U$14.4 28.04,5.7 26.84,4.51 v26.42,4.51
  Bottom 0.254: JP1.14 11.05,1.65 SJ1.1 11.05,3.94 11.43,4.32 26.23,4.32 v26.42,4.51
BOOST_EN
  Top 0.254: U$14.26 42.88,11.86 43.37,12.35 43.37,15.28 IC3.3
CAN1_RX
  Top 0.254: IC1.4 38.92,13.27 38.52,12.86 U$14.28
CAN1_S
  Top 0.254: IC1.8 42.74,10.35 41.72,11.36 U$14.25
CAN1_TX
  Top 0.254: U$14.27 36.73,12.36 42.38,12.36 42.74,12.72 IC1.1
CAN_H
  Top 0.254: X4.3 47.06,7.87 46.93,7.87 46.48,7.87 44.07,7.87 R10.2 42.61,6.73 41.47,7.87 IC1.7
CAN_L  (via drill 0.4)
  Top 0.254: v40.77,10.35 40.2,9.78 IC1.6 40.58,8.32 R11.2
  Bottom 0.254: v40.77,10.35 41.53,10.35 46.11,14.93 X4.1
CC1
  Top 0.254: R13.2 4.48,17.06 3.56,16.13 3.56,13.14 4.02,12.68 X6.A5
CC2
  Top 0.254: X6.B5 6.18,9.71 6.86,9.71 7.71,10.57 R12.2
D4  (via drill 0.4)
  Top 0.254: v36.32,14.64 35.95,14.64 35.67,14.36 U$14.31
  Bottom 0.254: JP1.1 44.45,4.32 38.8,9.97 38.8,11.75 38.54,12 37.21,12 36.32,12.89 v36.32,14.64
D5
  Top 0.254: U$14.35 33.04,16.25 33.63,16.84 33.63,17.7 33.24,18.09 33.24,19.8 33.44,20 35.1,20 35.52,20.42 37.33,20.42 38.12,21.21 38.93,21.21
  Top 0.305: JP3.10 38.93,21.21
D6
  Top 0.254: U$14.37 32.04,17.33 32.76,18.05 32.76,20.07 33.18,20.48 34.9,20.48 36.07,21.65 JP3.9
D8_NEOPIX  (via drill 0.39, 0.4)
  Top 0.254: LED1.1 17.72,7.5 v17.72,6.1 | v24.83,7.69 24.83,7.86 U$14.63
  Bottom 0.254: v17.72,6.1 17.78,6.16 23.36,6.16 24.83,7.63 v24.83,7.69
D9
  Top 0.254: U$14.38 31.54,17.51 32.28,18.25 32.28,20.27 33.66,21.65 JP3.8
D10
  Top 0.254: U$14.41 30.04,20.26 31.43,21.65 JP3.7
D11
  Top 0.254: 29.54,21.45 U$14.42
  Top 0.305: JP3.6 29.34,21.65 29.54,21.45
D12
  Top 0.254: U$14.43 29.04,20.16 27.54,21.65 JP3.5
D13  (via drill 0.39)
  Top 0.254: JP3.4 24.95,21.65 26.12,20.48 27.84,20.48 28.54,19.78 U$14.44 | R7.1 4.85,21.75 v4.45,22.16
  Bottom 0.254: JP3.4 23.5,21.65 22.33,20.48 21.23,20.48 21.21,20.51 20.57,20.51 19.49,19.43 14.16,19.43 12.7,17.97 10.79,17.97 6.6,22.16 v4.45,22.16
D+  (via drill 0.39, 0.4, 0.5)
  Top 0.254: U$14.46 27.54,17.42 27.29,17.66 v27.29,18.4 | v4.7,11.24 4.7,10.99 5,10.68 X6.B6 | v4.7,11.24 2.48,11.24 D+1.TP | v4.7,11.24 5.14,11.68 X6.A6
  Bottom 0.254: v4.7,11.24 7.49,11.24 14.67,18.41 20,18.41 20.45,18.86 21.78,18.86 22.29,18.35 27.24,18.35 v27.29,18.4
  other vias: 1.46,10.22
D-  (via drill 0.39, 0.4, 0.5)
  Top 0.254: v7.43,12.89 7.18,12.64 7.18,12.19 | 7.18,12.19 7.18,11.43 6.93,11.18 X6.A7 | 7.18,12.19 6.16,12.19 X6.B7 2.04,12.18 D-1.TP | v27.56,19.43 28.04,18.95 U$14.45
  Bottom 0.254: v7.43,12.89 8.3,12.89 14.34,18.92 19.75,18.92 20.19,19.37 21.97,19.37 22.48,18.86 26.54,18.86 27.11,19.43 v27.56,19.43
  other vias: 1.4,12.83
EN  (via drill 0.39)
  Top 0.254: R3.1 16.99,10.52 16.13,9.65 U2.3 16.67,9.62 16.95,9.34 v17.14,9.34 | v20.45,16.57 20.64,16.76 20.64,20.07 JP3.2
  Bottom 0.254: v17.14,9.34 17.14,9.53 19.91,12.29 19.91,16.23 20.35,16.67 v20.45,16.57
GND  (via drill 0.39, 0.4)
  Top 0.203: U$14.33 34.2,15.4
  Top 0.254: U$14.33 34.04,14.37 34.05,14.37 34.05,14.1 | C10.2 29.54,5.93 U$14.7 | v23.05,11.81 23.52,11.81 24.07,12.36 26.89,12.36 27.5,11.75 27.5,11.24 27.69,11.05 v28.57,11.05
  Top 0.305: C11.2 19.32,9.04 C13.2 19.49,10.44 20.08,11.03 20.08,11.21 20.61,11.75 v20.87,11.75 | X6.B1A12 6.46,8.23 7.25,7.44 7.31,7.5 | 7.31,7.5 SW1.B 7.47,7.14 6.86,6.52 | R12.1 7.87,8.06 7.31,7.5 | U2.2 15.18,8.8 14.99,8.61 12.8,8.61 12.72,8.53 v12.72,7.39 | C2.2 19.95,5.98 20.7,6.73 C4.2 | IC3.2 41.78,14.92 41.47,14.61 IC1.2 | C5.2 37.16,16.95 35.94,18.16 C17.2 | 34.2,15.4 36.64,15.4 36.79,15.24 v37.15,15.24 | C15.2 22.67,15.39 22.75,15.47 23.09,15.47 22.97,15.6 22.97,16.76 22.86,16.87 R9.7
  other vias: 9.72,7.62 18.22,9.08 14.35,16.38 8.57,16.7 6.22,5.84 17.78,20.89 9.33,21.72 12.76,21.84 23.56,19.75 20.65,14.48 10.22,12.45 18.15,15.16 30.29,9.27 28.51,12.89 28.57,9.27 30.48,10.73 32.07,12.89 25.59,19.94 30.42,14.61 33.78,12.57 26.99,7.87 40.61,20.87 35.37,3.24 38.16,6.92 7.56,18.1 15.14,5.42 40.83,2.92 46.04,3.17 49.47,13.21 43.75,16.83 38.05,20.03 38.4,17.17 34.66,19.14 48.32,18.03 46.04,20.83 8.61,14.78 39.69,10.6 43.37,10.99
  pour Top: 0,22.86 0,0 50.86,-0.06 50.86,22.86
  pour Bottom: 50.86,0 0,0 0,22.86 50.86,22.86
MISO  (via drill 0.4)
  Top 0.254: U$14.49 25.65,15.05 v25.65,15.6
  Bottom 0.254: JP1.4 35.94,1.27 34.77,2.44 34.01,2.44 31.98,4.47 31.98,11.69 29.1,14.57 26.05,14.57 25.65,14.96 v25.65,15.6
MOSI  (via drill 0.4)
  Top 0.254: U$14.50 25.41,14.36 25.14,14.09 v24.84,14.09
  Bottom 0.254: v24.84,14.09 28.9,14.09 31.5,11.49 | JP1.5 34.29,1.46 31.53,4.22 31.53,4.24 31.5,4.27 31.5,11.49 | 31.5,11.49
N$1
  Top 0.254: R2.1 4.66,4.76 4.26,4.76 3.72,5.3 3.62,5.4 CHG.C
N$2
  Top 0.254: R7.2 5.52,19.89 5.2,19.89 2.74,17.42 L.A
N$3  (via drill 0.39)
  Top 0.254: v7.81,4.45 7.75,4.51 R2.2 | v17.08,15.06 17.09,15.06 17.39,14.77 17.39,14.5 17.66,14.23 U3.1
  Bottom 0.254: v7.81,4.45 8.45,5.08 8.45,9.08 14.43,15.06 v17.08,15.06
N$4
  Top 0.254: R8.1 17.95,17.84 17.95,16.8 U3.5
N$6
  Top 0.203: SJ2.2 44.07,4.51 R10.1
N$7
  Top 0.254: U$14.1 26.24,6.36 25.7,6.36 24.34,5 X2.P$2 24.21,5.21 C4.1
N$8
  Top 0.254: IC3.6 40.83,17.81 41.12,17.53 43.34,17.53 C18.2
N$9
  Top 0.254: IC3.4 42.73,18.89 43.21,19.37 44.84,19.37 45.98,18.22 C18.1
N$10
  Top 0.254: C2.1 21.04,4.28 21.77,5 X2.P$1 21.81,3.84 22.12,3.53 24.83,3.53 25.17,3.87 25.17,5.15 25.9,5.88 26.68,5.88 27.04,6.24 U$14.2
N$11
  Top 0.254: U$14.55 24.28,11.86 23.15,10.73 21.73,10.73 L2.P$2
N$13
  Top 0.203: R11.1 41.59,3.56 45.09,3.56 45.91,4.38 SJ2.1
NEO_PWR  (via drill 0.39)
  Top 0.254: U$14.64 25.1,6.63 v24.87,6.63
  Top 0.305: LED1.2 15.81,7.66 15.81,6.32 16.26,5.87 v16.26,5.81
  Bottom 0.254: v16.26,5.81 16.7,5.37 18.27,5.37 18.58,5.68 23.92,5.68 v24.87,6.63
QSPI_CS  (via drill 0.4)
  Top 0.254: U$14.24 37.08,10.86 37.4,10.54 v37.53,10.54 | U1.1 35.89,6.71 36.08,6.52 36.97,6.52 v37.34,6.16 37.34,4.95 R5.1
  Bottom 0.254: v37.53,10.54 37.53,9.29 37.88,8.94 37.88,8.33 37.34,7.79 v37.34,6.16
QSPI_DATA[0]  (via drill 0.4)
  Top 0.254: v36.2,5.77 36.05,5.92 35.68,5.92 34.74,6.85 U$14.17 | U1.5 37.39,8.88 v37.15,8.64
  Bottom 0.254: v36.2,5.77 36.59,6.15 36.59,7.76 37.15,8.32 v37.15,8.64
QSPI_DATA[1]
  Top 0.254: U$14.18 36.17,7.86 36.39,7.64 U1.2
QSPI_DATA[2]
  Top 0.254: U$14.19 35.56,8.36 35.63,8.43 36.29,8.43 36.89,7.83 U1.3
QSPI_DATA[3]
  Top 0.254: U1.7 36.39,9.09 36.23,8.93 35.44,8.93 35.37,8.86 U$14.20
QSPI_SCK
  Top 0.254: U1.6 36.89,9.95 36.87,9.97 36.87,10.11 36.62,10.36 U$14.23
RX_D0  (via drill 0.4)
  Top 0.254: U$14.40 30.54,18.03 30.8,18.29 v30.8,18.52
  Bottom 0.254: JP1.3 38.73,1.27 37.47,2.54 37.2,2.54 34.54,5.19 34.54,17.27 33.4,18.41 30.9,18.41 v30.8,18.52
SCK  (via drill 0.4)
  Top 0.254: JP1.6 31.81,1.27 34.03,3.49 v34.17,3.49 | U$14.36 32.54,16.79 v32.84,17.08
  Bottom 0.254: v32.84,17.08 33,16.91 33,12.18 32.46,11.63 32.46,5.2 v34.17,3.49
SCL  (via drill 0.4)
  Top 0.254: U$14.30 34.76,13.88 37.08,13.88 37.87,14.67 v37.98,14.67
  Bottom 0.254: v37.98,14.67 38.87,14.67 43.06,18.86 43.06,20.46 41.91,21.61 JP3.11
SDA  (via drill 0.4)
  Top 0.254: v37.97,13.64 37.7,13.36 U$14.29
  Bottom 0.254: v37.97,13.64 38.59,13.64 43.62,18.67 43.62,20.83 JP3.12
SWCLK  (via drill 0.39)
  Top 0.254: U$14.57 24.71,10.86 23.37,9.53 v23.37,9.21 23.37,9.14 22.5,8.28 R6.2
  Bottom 0.254: TP1.P$1 v23.37,9.21
SWDIO  (via drill 0.39)
  Top 0.254: U$14.58 24.9,10.36 24.1,9.56 24.1,7.97 v23.75,7.62
  Bottom 0.254: TP2.P$1 23.43,7.3 v23.75,7.62
TX_D1  (via drill 0.4)
  Top 0.254: U$14.39 31.04,17.72 31.57,18.25 31.57,19.17 v31.54,19.2
  Bottom 0.254: JP1.2 41.02,1.27 38.74,3.56 36.88,3.56 35.03,5.41 35.03,17.54 33.66,18.9 31.84,18.9 v31.54,19.2
V_DIV  (via drill 0.39)
  Top 0.254: R9.2 R9.1 24.63,15.11 v24.7,15.11 | U$14.61 25.3,8.86 24.96,9.21 v24.83,9.21
  Bottom 0.254: v24.83,9.21 24.83,13.02 24.07,13.78 24.07,14.48 v24.7,15.11
VBAT
  Top 0.203: 18.86,19.56 18.86,17.14
  Top 0.305: 18.86,17.14 18.8,17.08 18.8,15.86 19.42,15.24 19.56,15.24 | R9.8 21.69,15.97 20.95,15.24 19.56,15.24 | 16.51,19.43 16.64,19.56 18.86,19.56 | Q3.3 10.86,10.78 11.24,11.16 11.24,13.99 11.92,14.67 X1.2 14.48,18.16 C3.1 16.51,18.79 16.51,19.43 | JP3.1 16.51,19.43 | U3.3 19.55,15.24 19.56,15.24
VBUS  (via drill 0.39, 0.5)
  Top 0.254: 9.08,8.84 Q3.1
  Top 0.305: 9.08,8.84 9.08,11.93 D4.A 8.37,12.64 8.37,13.43 7.98,13.83 7.68,13.83 | U3.4 19.55,16.03 19.78,15.81 20.77,15.81 21.21,16.26 21.21,17.65 | v4.34,13.46 5.19,13.46 5.56,13.83 X6.A4B9 7.68,13.83 | X6.B4A9 5.56,9.03 5.25,9.34 v3.75,9.34 3.75,7.43 2.48,6.16 1.47,6.16 1.03,5.71 CHG.A | v12.26,19.18 9.97,19.18 7.68,16.89 7.68,13.83 | 21.21,17.65 21.21,21.14 21.59,21.53 JP3.3 | R9.6 22.05,17.65 21.21,17.65
  Bottom 0.305: JP3.3 20.95,21.65 19.24,19.94 13.02,19.94 v12.26,19.18 | v4.34,13.46 3.43,12.55 3.43,9.65 v3.75,9.34
VDDCORE1
  Top 0.254: L2.P$1 21.89,13.14 22.23,13.14 22.77,12.61 23.61,12.61 23.86,12.86 U$14.53 | L2.P$1 21.47,13.02 20.32,13.02 19.65,12.34 C13.1 | L2.P$1 21.75,12.87 23.41,14.54 C15.1
VHI  (via drill 0.4)
  Top 0.305: R3.2 17.56,12.1 16.45,10.99 v16,10.99 14.23,10.99 | C17.1 37.84,18.67 38.73,19.56 41.23,19.56 v41.44,19.77 41.44,19.65 41.78,19.3 IC3.5 | Q3.2 11.05,9.52 12.18,10.66 C6.1 | U2.1 14.23,10.99 | D4.C 12.68,12.03 C6.1 | 14.23,10.99 13,10.99 C6.1
  Bottom 0.305: v16,10.99 17.02,10.99 18.91,12.88 18.91,17.26 19.49,17.84 20.26,17.84 20.7,18.29 21.46,18.29 21.97,17.78 26.85,17.78 26.98,17.65 27.86,17.65 28.32,18.1 28.32,19.36 29.41,20.45 34.99,20.45 36.93,18.5 40.17,18.5 v41.44,19.77

### Text on the board
tPlace: BAT | En | USB | 13 | 12 | 11 | 10 | 9 | 6 | 5 | SCL | SDA | Feather / M4 CAN | 13 | L | CANBUS | RST | CHG | Trm | H | SCK | MOSI | RST | 3V | ARf | GND | A0 | A1 | A2 | A3 | A4 | A5 | MIS | RX | TX | D4
bPlace: 3.7/4.2V / LiPoly Batt / µUSB charge | 9 | 6 | 5 | SCL | BAT | En | USB | 13 | 12 | 11 | 10 | SDA | LOW | ATSAME51J19 / 120MHz & 3.3V | Feather M4 / CAN Express | GND | swclk | HIGH | swdio | RST | 3V | ARf | GND | SCK | MOSI | MISO | A0 | A1 | A2 | A3 | A4 | A5 | RX | TX | D4